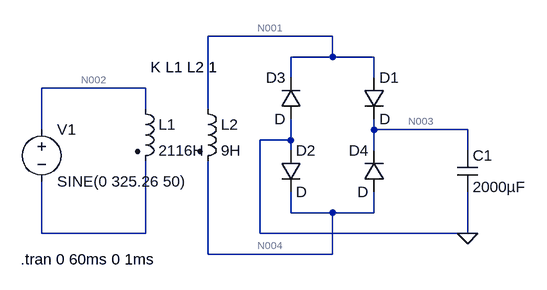
[diagram p0: schematic Draft1.asc]
Draft1.asc, the LTspice schematic file:
Version 4
SHEET 1 880 680
WIRE 336 80 144 80
WIRE 336 112 336 80
WIRE 336 112 272 112
WIRE 400 112 336 112
WIRE 272 144 272 112
WIRE 400 144 400 112
WIRE 48 160 -112 160
WIRE 48 192 48 160
WIRE 144 192 144 80
WIRE -112 224 -112 160
WIRE 400 224 400 208
WIRE 544 224 400 224
WIRE 272 240 272 208
WIRE 272 240 224 240
WIRE 272 256 272 240
WIRE 400 256 400 224
WIRE 544 256 544 224
WIRE 272 352 272 320
WIRE 336 352 272 352
WIRE 400 352 400 320
WIRE 400 352 336 352
WIRE -112 384 -112 304
WIRE 48 384 48 272
WIRE 48 384 -112 384
WIRE 224 384 224 240
WIRE 544 384 544 320
WIRE 544 384 224 384
WIRE 144 416 144 272
WIRE 336 416 336 352
WIRE 336 416 144 416
FLAG 544 384 0
SYMBOL voltage -112 208 R0
WINDOW 123 0 0 Left 0
WINDOW 39 0 0 Left 0
SYMATTR InstName V1
SYMATTR Value SINE(0 325.26 50)
SYMBOL ind2 32 176 R0
SYMATTR InstName L1
SYMATTR SpiceLine Rser=0.001
SYMATTR Value 2116H
SYMATTR Type ind
SYMBOL ind2 128 176 R0
SYMATTR InstName L2
SYMATTR Value 9H
SYMATTR Type ind
SYMBOL diode 384 144 R0
SYMATTR InstName D1
SYMBOL diode 256 256 R0
SYMATTR InstName D2
SYMBOL diode 288 208 R180
WINDOW 0 24 64 Left 2
WINDOW 3 24 0 Left 2
SYMATTR InstName D3
SYMBOL diode 416 320 R180
WINDOW 0 24 64 Left 2
WINDOW 3 24 0 Left 2
SYMATTR InstName D4
SYMBOL cap 528 256 R0
SYMATTR InstName C1
SYMATTR Value 2000µF
TEXT 56 128 Left 2 !K L1 L2 1
TEXT -144 424 Left 2 !.tran 0 60ms 0 1ms

The netlist it stands for:
* Draft1.asc
V1 N002 N005 SINE(0 325.26 50)
L1 N002 N005 2116H Rser=0.001
L2 N001 N004 9H
D1 N001 N003 D
D2 0 N004 D
D3 0 N001 D
D4 N004 N003 D
C1 N003 0 2000µF
.model D D
.lib standard.dio
K L1 L2 1
.tran 0 60ms 0 1ms
.backanno
.end

* Results of the author's LTspice run, read from the files saved beside the schematic
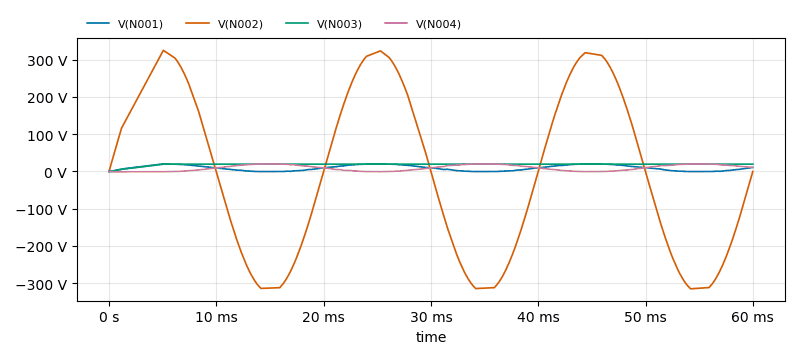
[diagram p1: Transient Analysis of Draft1.asc, plotted from the saved traces]
* Transient Analysis, 1 run:
*   V(N001): min -719.5 mV, max 20.41 V, average 9.285 V, rms 11.91 V, last 10.83 V
*   V(N002): min -324.5 V, max 325.3 V, average -98.31 mV, rms 230.1 V, last 0 V
*   V(N003): min 0 V, max 19.7 V, average 18.99 V, rms 19.22 V, last 19.7 V
*   V(N004): min -901.1 mV, max 20.39 V, average 9.306 V, rms 12.16 V, last 10.83 V